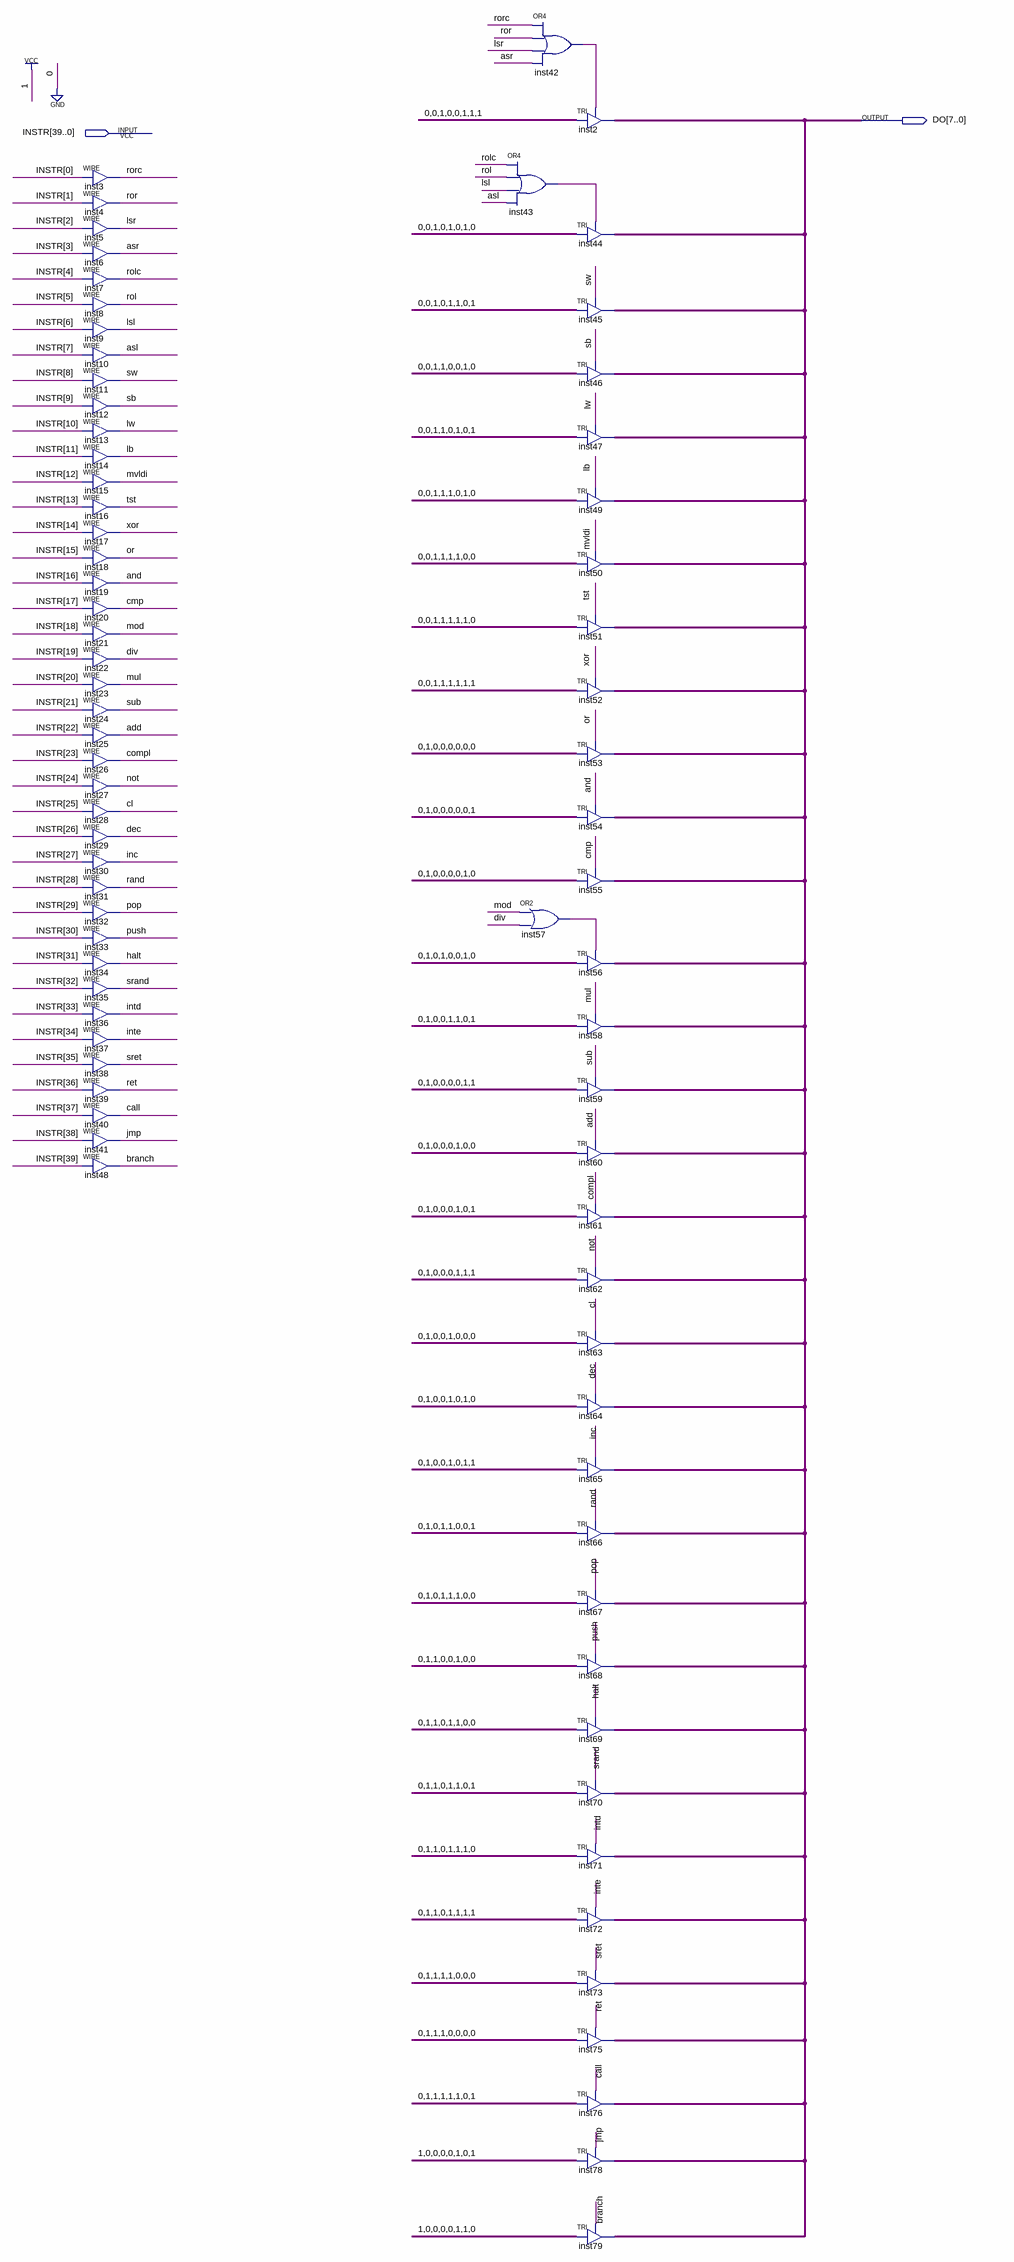
[diagram p0: schematic sheet]
// Quartus schematic KMOPR.bdf as structural Verilog: 76 symbols, 2 pins
module KMOPR (
  input  [39:0] INSTR,
  output [7:0] DO
);

  wire add, \and , asl, asr, branch, call, cl, cmp, compl, dec, div, halt, inc, inst42_out, inst43_out,
       inst57_out, intd, inte, jmp, lb, lsl, lsr, lw, mod, mul, mvldi, \not , \or , pop, push, \rand , ret,
       rol, rolc, ror, rorc, sb, srand, sret, sub, sw, tst, \xor ;

  assign rorc = INSTR[0];  // WIRE inst3
  assign ror = INSTR[1];  // WIRE inst4
  assign lsr = INSTR[2];  // WIRE inst5
  assign asr = INSTR[3];  // WIRE inst6
  assign rolc = INSTR[4];  // WIRE inst7
  assign rol = INSTR[5];  // WIRE inst8
  assign lsl = INSTR[6];  // WIRE inst9
  assign asl = INSTR[7];  // WIRE inst10
  assign sw = INSTR[8];  // WIRE inst11
  assign sb = INSTR[9];  // WIRE inst12
  assign lw = INSTR[10];  // WIRE inst13
  assign lb = INSTR[11];  // WIRE inst14
  assign mvldi = INSTR[12];  // WIRE inst15
  assign tst = INSTR[13];  // WIRE inst16
  assign \xor  = INSTR[14];  // WIRE inst17
  assign \or  = INSTR[15];  // WIRE inst18
  assign \and  = INSTR[16];  // WIRE inst19
  assign cmp = INSTR[17];  // WIRE inst20
  assign mod = INSTR[18];  // WIRE inst21
  assign div = INSTR[19];  // WIRE inst22
  assign mul = INSTR[20];  // WIRE inst23
  assign sub = INSTR[21];  // WIRE inst24
  assign add = INSTR[22];  // WIRE inst25
  assign compl = INSTR[23];  // WIRE inst26
  assign \not  = INSTR[24];  // WIRE inst27
  assign cl = INSTR[25];  // WIRE inst28
  assign dec = INSTR[26];  // WIRE inst29
  assign inc = INSTR[27];  // WIRE inst30
  assign \rand  = INSTR[28];  // WIRE inst31
  assign pop = INSTR[29];  // WIRE inst32
  assign push = INSTR[30];  // WIRE inst33
  assign halt = INSTR[31];  // WIRE inst34
  assign srand = INSTR[32];  // WIRE inst35
  assign intd = INSTR[33];  // WIRE inst36
  assign inte = INSTR[34];  // WIRE inst37
  assign sret = INSTR[35];  // WIRE inst38
  assign ret = INSTR[36];  // WIRE inst39
  assign call = INSTR[37];  // WIRE inst40
  assign jmp = INSTR[38];  // WIRE inst41
  assign branch = INSTR[39];  // WIRE inst48
  or inst42 (inst42_out, rorc, ror, lsr, asr);
  or inst43 (inst43_out, rolc, rol, lsl, asl);
  or inst57 (inst57_out, mod, div);
  TRI inst2[7:0] (.IN(8'b00100111), .OE(inst42_out), .OUT(DO));
  TRI inst44[7:0] (.IN(8'b00101010), .OE(inst43_out), .OUT(DO));
  TRI inst45[7:0] (.IN(8'b00101101), .OE(sw), .OUT(DO));
  TRI inst46[7:0] (.IN(8'b00110010), .OE(sb), .OUT(DO));
  TRI inst47[7:0] (.IN(8'b00110101), .OE(lw), .OUT(DO));
  TRI inst49[7:0] (.IN(8'b00111010), .OE(lb), .OUT(DO));
  TRI inst50[7:0] (.IN(8'b00111100), .OE(mvldi), .OUT(DO));
  TRI inst51[7:0] (.IN(8'b00111110), .OE(tst), .OUT(DO));
  TRI inst52[7:0] (.IN(8'b00111111), .OE(\xor ), .OUT(DO));
  TRI inst53[7:0] (.IN(8'b01000000), .OE(\or ), .OUT(DO));
  TRI inst54[7:0] (.IN(8'b01000001), .OE(\and ), .OUT(DO));
  TRI inst55[7:0] (.IN(8'b01000010), .OE(cmp), .OUT(DO));
  TRI inst56[7:0] (.IN(8'b01010010), .OE(inst57_out), .OUT(DO));
  TRI inst58[7:0] (.IN(8'b01001101), .OE(mul), .OUT(DO));
  TRI inst59[7:0] (.IN(8'b01000011), .OE(sub), .OUT(DO));
  TRI inst60[7:0] (.IN(8'b01000100), .OE(add), .OUT(DO));
  TRI inst61[7:0] (.IN(8'b01000101), .OE(compl), .OUT(DO));
  TRI inst62[7:0] (.IN(8'b01000111), .OE(\not ), .OUT(DO));
  TRI inst63[7:0] (.IN(8'b01001000), .OE(cl), .OUT(DO));
  TRI inst64[7:0] (.IN(8'b01001010), .OE(dec), .OUT(DO));
  TRI inst65[7:0] (.IN(8'b01001011), .OE(inc), .OUT(DO));
  TRI inst66[7:0] (.IN(8'b01011001), .OE(\rand ), .OUT(DO));
  TRI inst67[7:0] (.IN(8'b01011100), .OE(pop), .OUT(DO));
  TRI inst68[7:0] (.IN(8'b01100100), .OE(push), .OUT(DO));
  TRI inst69[7:0] (.IN(8'b01101100), .OE(halt), .OUT(DO));
  TRI inst70[7:0] (.IN(8'b01101101), .OE(srand), .OUT(DO));
  TRI inst71[7:0] (.IN(8'b01101110), .OE(intd), .OUT(DO));
  TRI inst72[7:0] (.IN(8'b01101111), .OE(inte), .OUT(DO));
  TRI inst73[7:0] (.IN(8'b01111000), .OE(sret), .OUT(DO));
  TRI inst75[7:0] (.IN(8'b01110000), .OE(ret), .OUT(DO));
  TRI inst76[7:0] (.IN(8'b01111101), .OE(call), .OUT(DO));
  TRI inst78[7:0] (.IN(8'b10000101), .OE(jmp), .OUT(DO));
  TRI inst79[7:0] (.IN(8'b10000110), .OE(branch), .OUT(DO));
endmodule
